# Altium schematic sheet misc.SchDoc
size 381 x 241 mm; SheetNumber: 9; SheetTotal: 12
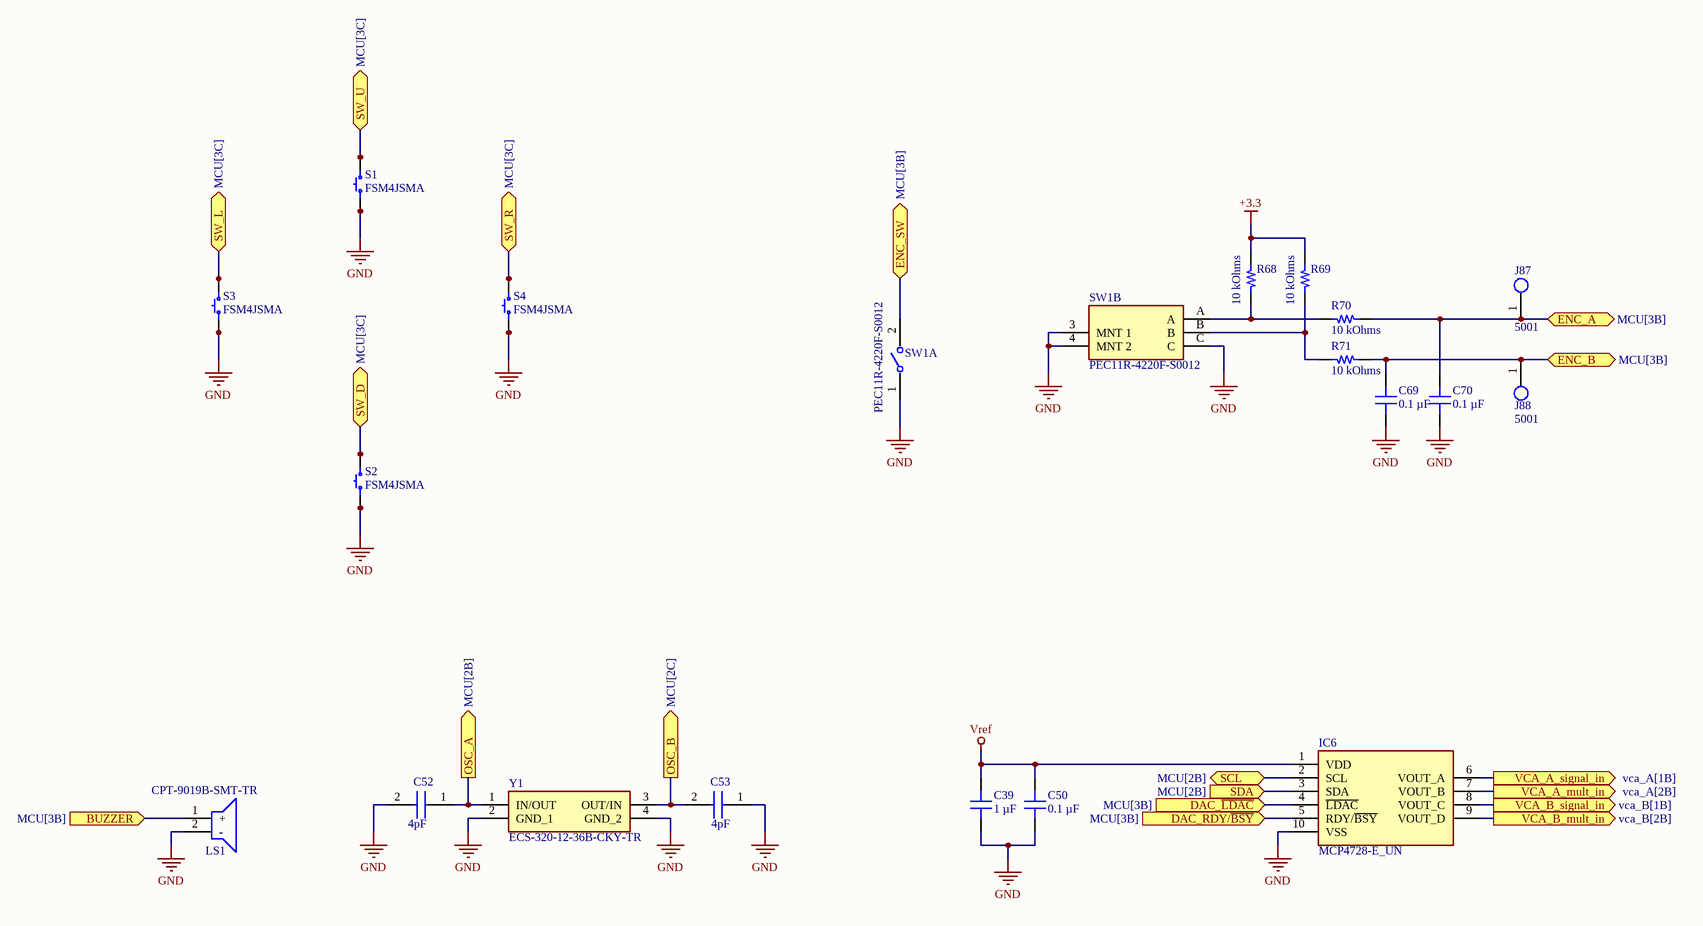
[diagram p0: misc.SchDoc]

## Parts
C39  1 µF  [CAP 1206_3216 - 0.8MM]
C50  0.1 µF  [CAP 1206_3216 - 0.8MM]
C52  4pF  [CAPC1608X80N]
C53  4pF  [CAPC1608X80N]
C69  0.1 µF  [CAP 1206_3216 - 0.8MM]
C70  0.1 µF  [CAP 1206_3216 - 0.8MM]
IC6  MCP4728-E_UN  [SOP50P490X110-10N]
J87  5001  [FP-5001-MFG]
J88  5001  [FP-5001-MFG]
LS1  CPT-9019B-SMT-TR  [CPT9019BSMTTR]
R68  10 kOhms  [YAGEO RES 1206_3216]
R69  10 kOhms  [YAGEO RES 1206_3216]
R70  10 kOhms  [YAGEO RES 1206_3216]
R71  10 kOhms  [YAGEO RES 1206_3216]
S1  FSM4JSMA  [TE FSM4JSMA]
S2  FSM4JSMA  [TE FSM4JSMA]
S3  FSM4JSMA  [TE FSM4JSMA]
S4  FSM4JSMA  [TE FSM4JSMA]
SW1  PEC11R-4220F-S0012  [FP-PEC11R-4220F-S0012-MFG]  (parts A,B of 2)
Y1  ECS-320-12-36B-CKY-TR  [ECS240836QAESTR]

## Ports
BUZZER (in, see MCU[3B]), DAC_RDY/~{BSY} (in, see MCU[3B]), DAC_~{LDAC} (in, see MCU[3B]), ENC_A (bidir, see MCU[3B]), ENC_B (bidir, see MCU[3B]), ENC_SW (bidir, see MCU[3B]), OSC_A (out, see MCU[2B]), OSC_B (out, see MCU[2C]), SCL (bidir, see MCU[2B]), SDA (in, see MCU[2B]), SW_D (bidir, see MCU[3C]), SW_L (bidir, see MCU[3C]), SW_R (bidir, see MCU[3C]), SW_U (bidir, see MCU[3C]), VCA_A_mult_in (out, see vca_A[2B]), VCA_A_signal_in (out, see vca_A[1B]), VCA_B_mult_in (out, see vca_B[2B]), VCA_B_signal_in (out, see vca_B[1B])

## Nets
+3.3: R68.1 R69.1
GND: C39.1 C50.1 C52.2 C53.1 C69.1 C70.1 IC6.10(VSS) LS1.2(-) S1.1 S1.2 S2.1 S2.2 S3.1 S3.2 S4.1 S4.2 SW1.1 SW1.3(MNT_1) SW1.4(MNT_2) SW1.C Y1.2(GND_1) Y1.4(GND_2)
Vref: C39.2 C50.2 IC6.1(VDD)
BUZZER: LS1.1(+) ; port BUZZER
DAC_~{LDAC}: IC6.4(~{LDAC}) ; port DAC_~{LDAC}
DAC_RDY/~{BSY}: IC6.5(RDY/~{BSY}) ; port DAC_RDY/~{BSY}
ENC_A: C70.2 J87.1 R70.2 ; port ENC_A
ENC_B: C69.2 J88.1 R71.2 ; port ENC_B
ENC_SW: SW1.2 ; port ENC_SW
OSC_A: C52.1 Y1.1(IN/OUT) ; port OSC_A
OSC_B: C53.2 Y1.3(OUT/IN) ; port OSC_B
SCL: IC6.2(SCL) ; port SCL
SDA: IC6.3(SDA) ; port SDA
SW_D: S2.3 S2.4 ; port SW_D
SW_L: S3.3 S3.4 ; port SW_L
SW_R: S4.3 S4.4 ; port SW_R
SW_U: S1.3 S1.4 ; port SW_U
VCA_A_mult_in: IC6.7(VOUT_B) ; port VCA_A_mult_in
VCA_A_signal_in: IC6.6(VOUT_A) ; port VCA_A_signal_in
VCA_B_mult_in: IC6.9(VOUT_D) ; port VCA_B_mult_in
VCA_B_signal_in: IC6.8(VOUT_C) ; port VCA_B_signal_in
NetR68_2: R68.2 R70.1 SW1.A
NetR69_2: R69.2 R71.1 SW1.B

## Library data of the parts
C39 = 885012208093: CAP CER 1UF 50V X7R 1206; manufacturer: Würth Elektronik; Tolerance: ±10%; Part Number: 885012208093; Capacitance: 1 µF; Applications: General Purpose; componentlink1description: Datasheet; componentlink1url: https://katalog.we-online.de/pbs/datasheet/885012208093.pdf; componentlink2description: DigiKey Link; componentlink2url: https://www.digikey.com/en/products/detail/würth-elektronik/885012208093/5453432; Device Package: 1206 (3216 Metric); lastupdated: 6/4/2024 19:10:33; Lifecycle Status: Active; Minimum Order: 1; Mounting Type: Surface Mount, MLCC; Operating Temperature: -55°C ~ 125°C; Package / Case: 1206 (3216 Metric); packaging: TapeAndReel; partid: 39665; Part Status: Active; price: 0.10; series: WCAP-CSGP; Size / Dimension: 0.126" L x 0.063" W (3.20mm x 1.60mm); Supplier 1: DigiKey; Supplier Part Number 1: 732-7577-1-ND; Temperature Coefficient: X7R; Thickness (Max): 0.075" (1.90mm); value: 1 µF; Voltage - Rated: 50V
C50 C69 C70 = 885012208087: CAP CER 0.1UF 50V X7R 1206; manufacturer: Würth Elektronik; Tolerance: ±10%; Part Number: 885012208087; Capacitance: 0.1 µF; Applications: General Purpose; componentlink1description: Datasheet; componentlink1url: https://katalog.we-online.de/pbs/datasheet/885012208087.pdf; componentlink2description: DigiKey Link; componentlink2url: https://www.digikey.com/en/products/detail/würth-elektronik/885012208087/5453982; Device Package: 1206 (3216 Metric); lastupdated: 6/4/2024 19:10:27; Lifecycle Status: Active; Minimum Order: 1; Mounting Type: Surface Mount, MLCC; Operating Temperature: -55°C ~ 125°C; Package / Case: 1206 (3216 Metric); packaging: TapeAndReel; partid: 20879; Part Status: Active; price: 0.06; series: WCAP-CSGP; Size / Dimension: 0.126" L x 0.063" W (3.20mm x 1.60mm); Supplier 1: DigiKey; Supplier Part Number 1: 732-8127-1-ND; Temperature Coefficient: X7R; Thickness (Max): 0.035" (0.90mm); value: 0.1 µF; Voltage - Rated: 50V
C52 C53 = C1608C0G1H040C080AA: Capacitor; Manufacturer_Name: TDK; Datasheet Link: https://product.tdk.com/info/en/catalog/datasheets/mlcc_commercial_midvoltage_en.pdf; Height: 0.8mm; Manufacturer_Part_Number: C1608C0G1H040C080AA; Arrow Part Number: C1608C0G1H040C080AA; Arrow Price/Stock: https://www.arrow.com/en/products/c1608c0g1h040c080aa/tdk
IC6 = MCP4728-E_UN: Integrated Circuit; Manufacturer_Name: Microchip; Manufacturer_Part_Number: MCP4728-E/UN; Datasheet Link: http://ww1.microchip.com/downloads/en/DeviceDoc/22187E.pdf; Height: 1.1mm; Mouser Part Number: 579-MCP4728-E/UN; Mouser Price/Stock: https://www.mouser.co.uk/ProductDetail/Microchip-Technology/MCP4728-E-UN?qs=E6wAi2XWqcP2zTenScklGA%3D%3D; Arrow Part Number: MCP4728-E/UN; Arrow Price/Stock: https://www.arrow.com/en/products/mcp4728-eun/microchip-technology?utm_currency=USD&region=nac
J87 J88 = CMP-2000-05181-2: PC TEST POINT MINIATURE BLACK; Body Material: Bronze; Plating: Silver; Inside Diameter: 1.27mm; Hole Diameter: 1.6mm; Number of Ports: 1; Outside Diameter: 2.54mm; Insulation: Insulated; Insulation Material: Nylon; Mount: Through Hole; RoHS Compliant: Yes; Series: THM; Height: 0.3inch; Termination: Through Hole; Material: Nylon; Packaging: Bulk; Contact Material: Bronze; REACH SVHC: No SVHC; Contact Plating: Silver; Orientation: Straight; Lead Free: Lead Free; Package Quantity: 100; Length: 7.62mm; Flammability Rating: UL94 V-0; Number of Contacts: 1; Diameter: 2.54mm; Housing Color: Black; Color: Black
LS1 = CPT-9019B-SMT-TR: Loudspeaker or Buzzer; Manufacturer_Name: Same Sky; Datasheet Link: https://www.sameskydevices.com/product/resource/supplyframepdf/cpt-9019b-smt-tr.pdf; Height: 2.1mm; Manufacturer_Part_Number: CPT-9019B-SMT-TR; Mouser Part Number: 179-CPT-9019B-SMT-TR; Mouser Price/Stock: https://www.mouser.co.uk/ProductDetail/CUI-Devices/CPT-9019B-SMT-TR?qs=3Rah4i%252BhyCGQOzp5C27TLw%3D%3D
R68-R71 = RT1206FRE0710KL: RES SMD 10K OHM 1% 1/4W 1206; Manufacturer: Yageo; Power (Watts): 0.25W, 1/4W; Temperature Coefficient: ±50ppm/°C; Part Number: RT1206FRE0710KL; ComponentLink1Description: Datasheet; ComponentLink1URL: https://www.yageo.com/upload/media/product/productsearch/datasheet/rchip/PYu-RT_1-to-0.01_RoHS_L_11.pdf; ComponentLink2Description: DigiKey Link; ComponentLink2URL: https://www.digikey.com/en/products/detail/yageo/RT1206FRE0710KL/1082868; Composition: Thin Film; Device Package: 1206 (3216 Metric); Height - Seated (Max): 0.026" (0.65mm); LastUpdated: 7/25/2024 09:21:28; Lifecycle Status: Active; Minimum Order: 1; Number of Terminations: 2; Operating Temperature: -55°C ~ 155°C; Package / Case: 1206 (3216 Metric); Packaging: TapeAndReel; PartId: 38903; Part Status: Active; Price: 0.01; Resistance: 10 kOhms; Series: RT; Size / Dimension: 0.122" L x 0.063" W (3.10mm x 1.60mm); Supplier 1: DigiKey; Supplier Part Number 1: YAG1242CT-ND; Supplier Device Package: 1206; Tolerance: ±1%; Value: 10 kOhms
S1-S4 = FSM4JSMA: SWITCH TACTILE SPST-NO 0.05A 24V; Manufacturer: TE Connectivity ALCOSWITCH Switches; Actuator Height off PCB, Vertical: 5.00mm; Actuator Orientation: Top Actuated; Actuator Type: Standard; Contact Rating @ Voltage: 0.05A @ 24VDC; Illumination: Non-Illuminated; Operating Force: 160gf; Outline: 6.00mm x 6.00mm; Switch Function: Off-Mom; Part Number: FSM4JSMA; Circuit: SPST-NO; ComponentLink1Description: Datasheet; ComponentLink1URL: https://www.te.com/commerce/DocumentDelivery/DDEController?Action=srchrtrv&DocNm=1308111-1_SWITCHES_CORE_PROGRAM_CATALOG&DocType=CS&DocLang=English; ComponentLink2Description: DigiKey Link; ComponentLink2URL: https://www.digikey.com/en/products/detail/te-connectivity-alcoswitch-switches/FSM4JSMA/525821; LastUpdated: 6/3/2024 20:19:31; Lifecycle Status: Active; Minimum Order: 1; Mounting Type: Surface Mount; Operating Temperature: -35°C ~ 85°C; Packaging: Bulk; Part Status: Active; Price: 0.14; Series: FSMJSMA; Supplier 1: DigiKey; Supplier Part Number 1: 450-1129-ND; Termination Style: Gull Wing
SW1 = PEC11R-4220F-S0012: ROTARY ENCODER MECHANICAL 12PPR; Built in Switch: Yes; Number of Channels: 2; Output Type: Quadrature; Hole Diameter: 7mm; Pulses per Revolution: 12; Termination: PC Pin; Package Quantity: 150; RoHS Compliant: Yes; Mount: Through Hole; Width: 12.5mm; Radiation Hardening: No; Number of Pins: 5; REACH SVHC: No SVHC; Type: Mechanical; Packaging: Bulk; Min Operating Temperature: -30°C; Encoder Type: Mechanical; Height: 13.4mm; Length: 26.5mm; Orientation: Vertical; Max Operating Temperature: 70°C; Series: PEC11R; Detent: Yes
Y1 = ECS-320-12-36B-CKY-TR: Crystal or Oscillator; Manufacturer_Name: ECS; Datasheet Link: https://www.ecsxtal.com/store/pdf/ECX-2236B.pdf; Height: 0mm; Manufacturer_Part_Number: ECS-320-12-36B-CKY-TR; Mouser Part Number: 520-320-12-36B-CKYT; Mouser Price/Stock: https://www.mouser.co.uk/ProductDetail/ECS/ECS-320-12-36B-CKY-TR?qs=l7cgNqFNU1juKISosFzRbg%3D%3D; Arrow Part Number: ECS-320-12-36B-CKY-TR; Arrow Price/Stock: https://www.arrow.com/en/products/ecs-320-12-36b-cky-tr/ecs-international